# EAGLE design 18F Proto2 (EAGLE 6.6.0)
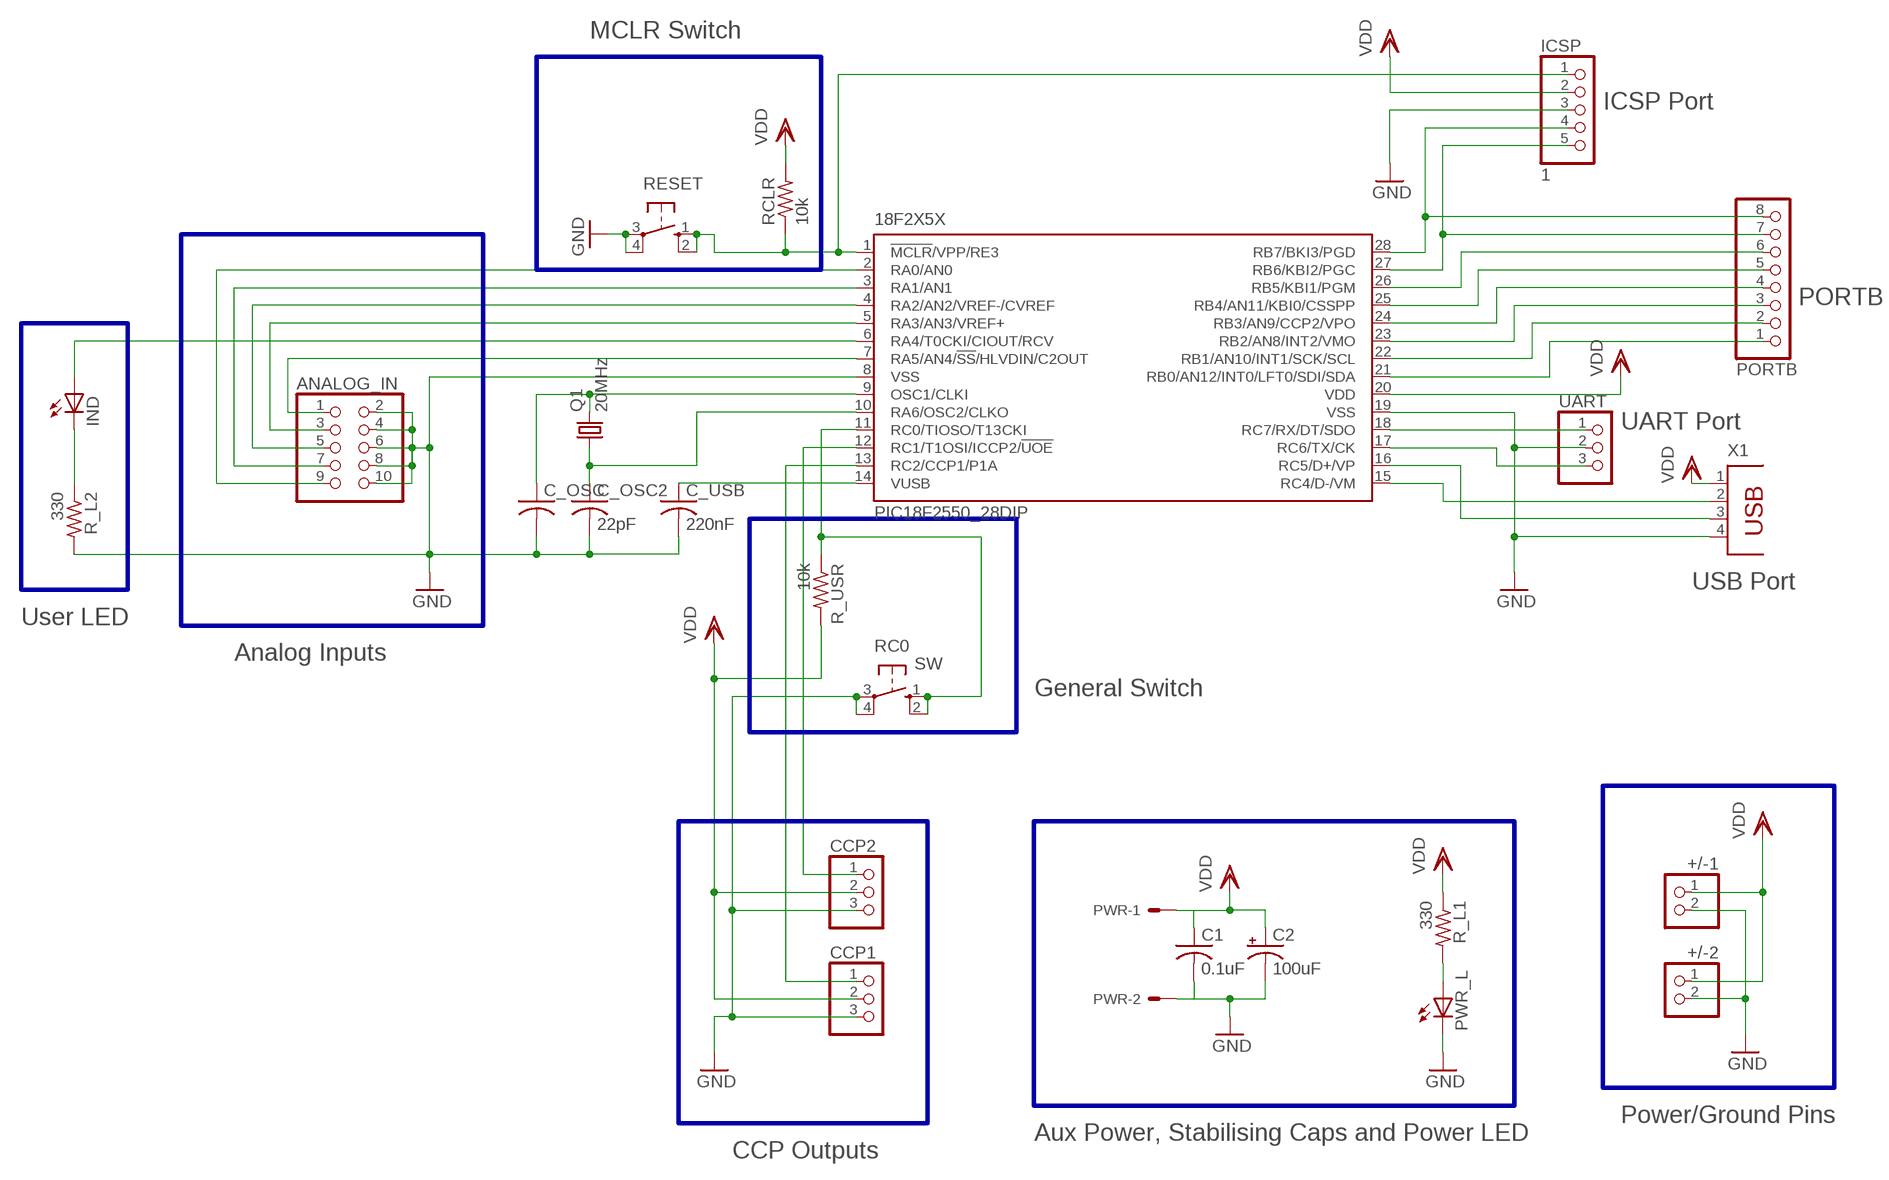
[diagram p0: schematic, sheet 1]

## Parts
18F2X5X  PIC18F2550_28DIP  [DIL28-3]
+/-1  PINHD-1X2  [1X02]
+/-2  PINHD-1X2  [1X02]
ANALOG_IN  PINHD-2X5  [2X05]
C1  0.1uF  C-US050-025X075  [C050-025X075]
C2  100uF  CPOL-USE2.5-6  [E2,5-6]
C_OSC  C-US025-025X050  [C025-025X050]
C_OSC2  22pF  C-US025-025X050  [C025-025X050]
C_USB  220nF  C-US050-025X075  [C050-025X075]
CCP1  PINHD-1X3  [1X03]
CCP2  PINHD-1X3  [1X03]
ICSP  1  PINHD-1X5  [1X05]
IND  LED3MM  [LED3MM]
PORTB  PINHD-1X8  [1X08]
PWR  22-23-2021  [22-23-2021]
PWR_L  LED3MM  [LED3MM]
Q1  20MHz  CRYSTALHC49S  [HC49/S]
R_L1  330  R-US_0204/7  [0204/7]
R_L2  330  R-US_0207/10  [0207/10]
R_USR  10k  R-US_0204/7  [0204/7]
RC0  SW  10-XX  [B3F-10XX]
RCLR  10k  R-US_0204/7  [0204/7]
RESET  10-XX  [B3F-10XX]
UART  PINHD-1X3  [1X03]
X1  PN61729  [PN61729]

## Nets
D+: 18F2X5X.16(RC5/D+/VP) X1.3
D-: 18F2X5X.15(RC4/D-/VM) X1.2
GND: 18F2X5X.8(VSS) 18F2X5X.19(VSS) +/-1.2 +/-2.2 ANALOG_IN.2 ANALOG_IN.4 ANALOG_IN.6 ANALOG_IN.8 ANALOG_IN.10 C1.2 C2.- C_OSC2.2 C_OSC.2 C_USB.2 CCP1.3 CCP2.3 ICSP.3 PWR.2 PWR_L.K(C) R_L2.2 RC0.3(P) RC0.4(P1) RESET.3(P) RESET.4(P1) UART.2 X1.4
MCLR: 18F2X5X.1(!MCLR!/VPP/RE3) ICSP.1 RCLR.1 RESET.1(S) RESET.2(S1)
N$4: 18F2X5X.10(RA6/OSC2/CLKO) C_OSC2.1 Q1.1
N$5: PWR_L.A R_L1.2
N$7: 18F2X5X.9(OSC1/CLKI) C_OSC.1 Q1.2
N$9: 18F2X5X.14(VUSB) C_USB.1
N$12: 18F2X5X.2(RA0/AN0) ANALOG_IN.9
N$13: 18F2X5X.3(RA1/AN1) ANALOG_IN.7
N$14: 18F2X5X.4(RA2/AN2/VREF-/CVREF) ANALOG_IN.5
N$15: 18F2X5X.5(RA3/AN3/VREF+) ANALOG_IN.3
N$16: 18F2X5X.6(RA4/T0CKI/CIOUT/RCV) IND.A
N$17: 18F2X5X.7(RA5/AN4/!SS!/HLVDIN/C2OUT) ANALOG_IN.1
N$18: IND.K(C) R_L2.1
N$19: 18F2X5X.11(RC0/TIOSO/T13CKI) R_USR.1 RC0.1(S) RC0.2(S1)
N$20: 18F2X5X.12(RC1/T1OSI/ICCP2/!UOE) CCP2.1
N$21: 18F2X5X.13(RC2/CCP1/P1A) CCP1.1
N$22: 18F2X5X.21(RB0/AN12/INT0/LFT0/SDI/SDA) PORTB.1
N$23: 18F2X5X.22(RB1/AN10/INT1/SCK/SCL) PORTB.2
N$24: 18F2X5X.23(RB2/AN8/INT2/VMO) PORTB.3
N$25: 18F2X5X.24(RB3/AN9/CCP2/VPO) PORTB.4
N$26: 18F2X5X.25(RB4/AN11/KBI0/CSSPP) PORTB.5
N$27: 18F2X5X.26(RB5/KBI1/PGM) PORTB.6
PGC: 18F2X5X.27(RB6/KBI2/PGC) ICSP.5 PORTB.7
PGD: 18F2X5X.28(RB7/BKI3/PGD) ICSP.4 PORTB.8
RX: 18F2X5X.18(RC7/RX/DT/SDO) UART.1
TX: 18F2X5X.17(RC6/TX/CK) UART.3
VDD: 18F2X5X.20(VDD) +/-1.1 +/-2.1 C1.1 C2.+ CCP1.2 CCP2.2 ICSP.2 PWR.1 R_L1.1 R_USR.2 RCLR.2 X1.1

## Buses
B$1
B$2
B$3
B$4
B$5
B$6
B$7

## Notes on the sheet
- MCLR Switch
- ICSP Port
- PORTB
- UART Port
- USB Port
- User LED
- Analog Inputs
- General Switch
- Power/Ground Pins
- Aux Power, Stabilising Caps and Power LED
- CCP Outputs

## Library data of the parts
18F2X5X = microchip:PIC18F2*_28: USB Microcontrollers with nanoWatt Technology High-Performance, Enhanced Flash, 28/40/44-Pin, Source: http://ww1.microchip.com/downloads/en/devicedoc/39632c.pdf; MF: MICROCHIP; MPN: PIC18F2550-I/SP; OC_FARNELL: 1523822; OC_NEWARK: 80K6054
+/-1 +/-2 = pinhead:PINHD-1X2: PIN HEADER
ANALOG_IN = pinhead:PINHD-2X5: PIN HEADER
C1 C_OSC C_OSC2 C_USB = rcl:C-US: CAPACITOR, American symbol
C2 = rcl:CPOL-US: POLARIZED CAPACITOR, American symbol
CCP1 CCP2 UART = pinhead:PINHD-1X3: PIN HEADER
ICSP = pinhead:PINHD-1X5: PIN HEADER
IND PWR_L = led:LED: LED OSRAM: - CHIPLED LG R971, LG N971, LY N971, LG Q971, LY Q971, LO R971, LY R971 LH N974, LH R974 LS Q976, LO Q976, LY Q976 LO Q996 - Hyper CHIPLED LW Q18S LB Q993, LB Q99A, LB R99A - SideLED LS A670, LO A670, LY A670, LG A670, LP A670 LB A673, LV A673, LT A673, LW A673 LH A674 LY A675 LS A676, LA A676, LO A676, LY A676, LW A676 LS A679, LY A679, LG A679 - Hyper Micro SIDELED® LS Y876, LA Y876, LO Y876, LY Y876 LT Y87S - SmartLED LW L88C, LW L88S LB L89C, LB L89S, LG L890 LS L89K, LO L89K, LY L89K LS L896, LA L896, LO L896, LY L896 - TOPLED LS T670, LO T670, LY T670, LG T670, LP T670 LSG T670, LSP T670, LSY T670, LOP T670, LYG T670 LG T671, LOG T671, LSG T671 LB T673, LV T673, LT T673, LW T673 LH T674 LS T676, LA T676, LO T676, LY T676, LB T676, LH T676, LSB T676, LW T676 LB T67C, LV T67C, LT T67C, LS T67K, LO T67K, LY T67K, LW E67C LS E67B, LA E67B, LO E67B, LY E67B, LB E67C, LV E67C, LT E67C LW T67C LS T679, LY T679, LG T679 LS T770, LO T770, LY T770, LG T770, LP T770 LB T773, LV T773, LT T773, LW T773 LH T774 LS E675, LA E675, LY E675, LS T675 LS T776, LA T776, LO T776, LY T776, LB T776 LHGB T686 LT T68C, LB T68C - Hyper Mini TOPLED® LB M676 - Mini TOPLED Santana® LG M470 LS M47K, LO M47K, LY M47K Source: http://www.osram.convergy.de LUXEON: - LUMILED® LXK2-PW12-R00, LXK2-PW12-S00, LXK2-PW14-U00, LXK2-PW14-V00 LXK2-PM12-R00, LXK2-PM12-S00, LXK2-PM14-U00 LXK2-PE12-Q00, LXK2-PE12-R00, LXK2-PE12-S00, LXK2-PE14-T00, LXK2-PE14-U00 LXK2-PB12-K00, LXK2-PB12-L00, LXK2-PB12-M00, LXK2-PB14-N00, LXK2-PB14-P00, LXK2-PB14-Q00 LXK2-PR12-L00, LXK2-PR12-M00, LXK2-PR14-Q00, LXK2-PR14-R00 LXK2-PD12-Q00, LXK2-PD12-R00, LXK2-PD12-S00 LXK2-PH12-R00, LXK2-PH12-S00 LXK2-PL12-P00, LXK2-PL12-Q00, LXK2-PL12-R00 Source: www.luxeon.com KINGBRIGHT: KA-3528ASYC Source: www.kingbright.com
PORTB = pinhead:PINHD-1X8: PIN HEADER
PWR = con-molex:22-23-2021: .100" (2.54mm) Center Header - 2 Pin; MF: MOLEX; MPN: 22-23-2021; OC_FARNELL: 1462926; OC_NEWARK: 25C3832
Q1 = crystal:CRYSTAL: CRYSTAL; OC_FARNELL: 1667008; OC_NEWARK: unknown
R_L1 R_L2 R_USR RCLR = rcl:R-US_: RESISTOR, American symbol
RC0 RESET = switch-omron:10-XX: OMRON SWITCH; MPN: B3F-1000; OC_FARNELL: 176432; OC_NEWARK: 36M3542
X1 = con-berg:PN61729: BERG USB connector; OC_FARNELL: unknown; OC_NEWARK: unknown

## Board
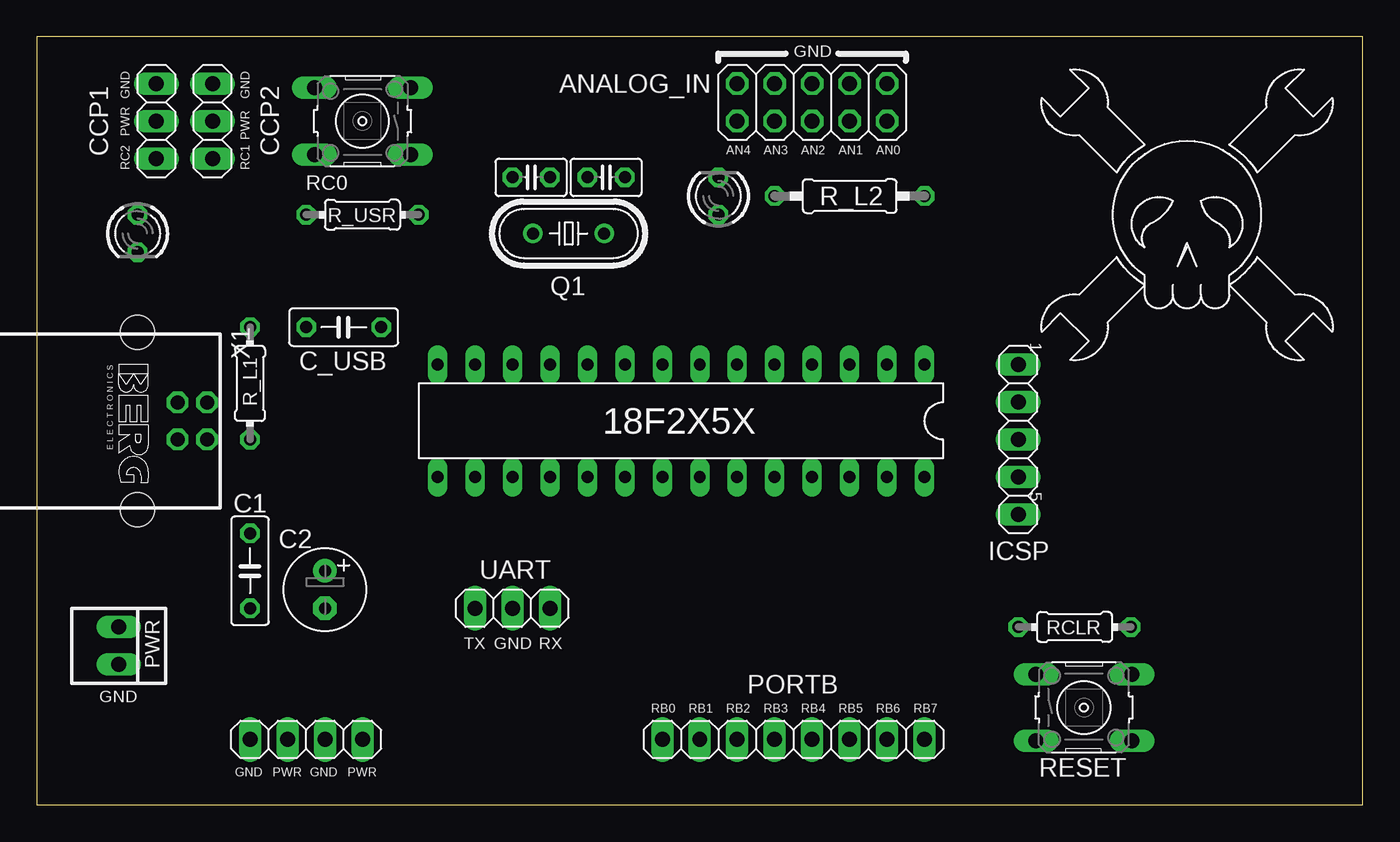
[diagram p1: board, top side]
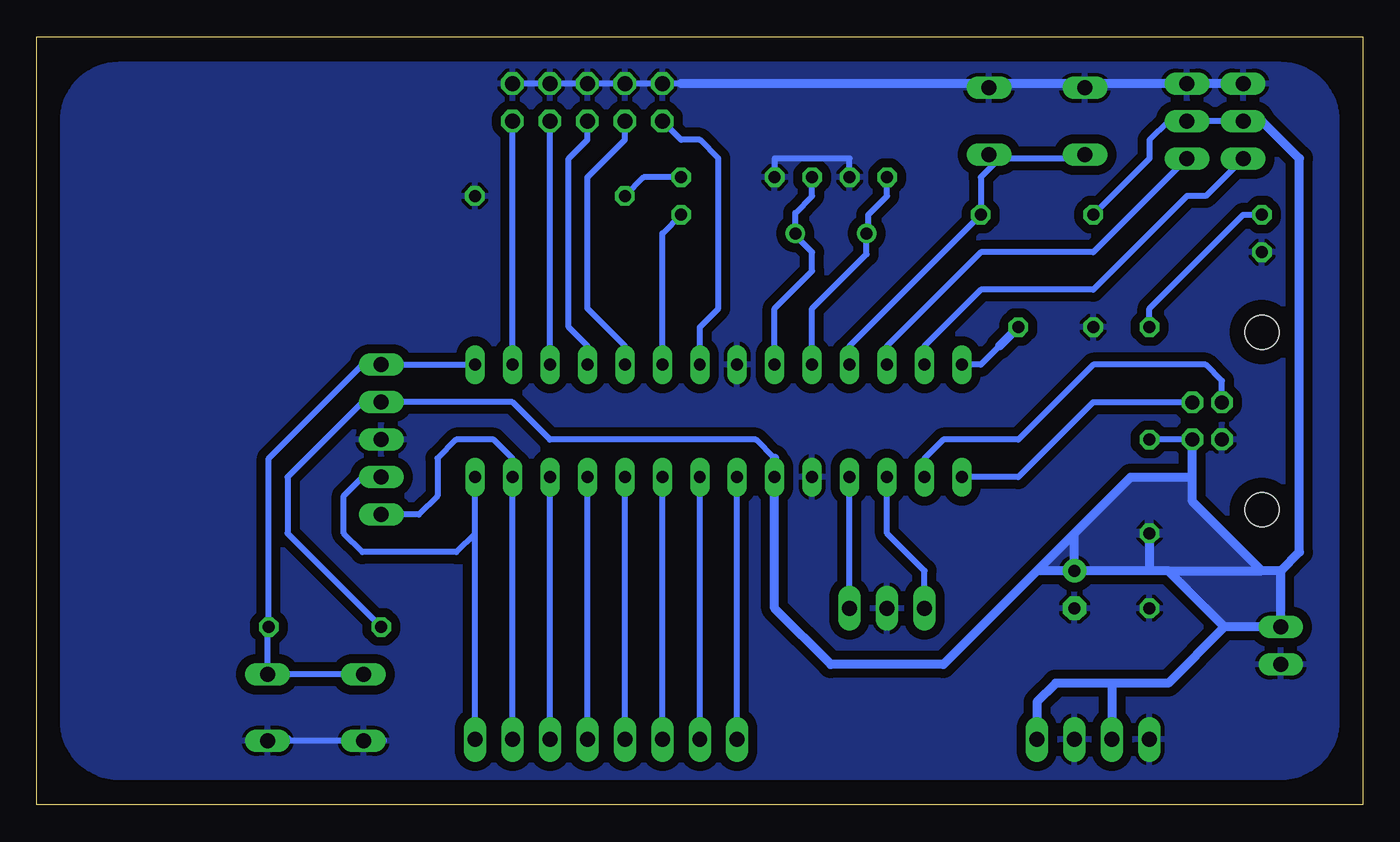
[diagram p2: board, bottom side, seen from below]

Size 89.84 x 52.06 mm. Coordinates in mm from the lower left corner, seen from the top.
Outline: 0,0 89.84,0 89.84,52.06 0,52.06 0,0
Copper layers (1*16): Top 0.035mm / dielectric 1.5mm / Bottom 0.035mm
Design rules "default *": minimum track width 10mil, minimum drill 24mil, track to track 8mil, track to pad 8mil, pad to pad 8mil, via to via 8mil, smd to smd 8mil, copper to edge 40mil, drill to drill 8mil, minimum pad ring 10mil, minimum via ring 8mil, stop-mask expansion 4mil, vias tented up to drill 0mil, thermal gap 10mil

### Footprints (pad centres in the part's own frame; a part is rotated, then mirrored left to right if it is on the bottom)
DIL28-3 = drill 0.813 long: 1 -16.51,-3.81; 2 -13.97,-3.81; 3 -11.43,-3.81; 4 -8.89,-3.81; 5 -6.35,-3.81; 6 -3.81,-3.81; 7 -1.27,-3.81; 8 1.27,-3.81; 9 3.81,-3.81; 10 6.35,-3.81; 11 8.89,-3.81; 12 11.43,-3.81; 13 13.97,-3.81; 14 16.51,-3.81; 15 16.51,3.81; 16 13.97,3.81; 17 11.43,3.81; 18 8.89,3.81; 19 6.35,3.81; 20 3.81,3.81; 21 1.27,3.81; 22 -1.27,3.81; 23 -3.81,3.81; 24 -6.35,3.81; 25 -8.89,3.81; 26 -11.43,3.81; 27 -13.97,3.81; 28 -16.51,3.81
1X02 = drill 1.016 long: 1 -1.27,0; 2 1.27,0
2X05 = drill 1.016 octagon: 1 -5.08,-1.27; 2 -5.08,1.27; 3 -2.54,-1.27; 4 -2.54,1.27; 5 0,-1.27; 6 0,1.27; 7 2.54,-1.27; 8 2.54,1.27; 9 5.08,-1.27; 10 5.08,1.27
C050-025X075 = drill 0.813 octagon: 1 -2.54,0; 2 2.54,0
E2,5-6 = drill 0.813 pad 1.6: + -1.27,0 | drill 0.813 pad 1.6 octagon: - 1.27,0
C025-025X050 = drill 0.813 octagon: 1 -1.27,0; 2 1.27,0
1X03 = drill 1.016 long: 1 -2.54,0; 2 0,0; 3 2.54,0
1X05 = drill 1.016 long: 1 -5.08,0; 2 -2.54,0; 3 0,0; 4 2.54,0; 5 5.08,0
LED3MM = drill 0.813 octagon: A -1.27,0; K 1.27,0
1X08 = drill 1.016 long: 1 -8.89,0; 2 -6.35,0; 3 -3.81,0; 4 -1.27,0; 5 1.27,0; 6 3.81,0; 7 6.35,0; 8 8.89,0
22-23-2021 = drill 1 long: 1 -1.27,0; 2 1.27,0
HC49/S = drill 0.813: 1 -2.413,0; 2 2.413,0
0204/7 = drill 0.813 octagon: 1 -3.81,0; 2 3.81,0
0207/10 = drill 0.813 octagon: 1 -5.08,0; 2 5.08,0
B3F-10XX = drill 1.016 long: 1 -3.251,2.261; 2 3.251,2.261; 3 -3.251,-2.261; 4 3.251,-2.261
PN61729 = drill 0.95 octagon: 1 1.25,4.71; 2 -1.25,4.71; 3 -1.25,2.71; 4 1.25,2.71 | hole 2.3: -6.02,0; 6.02,0

### Placement (x,y rotation side)
18F2X5X  43.65,26.03 180 top
+/-1  15.71,4.44 180 top
+/-2  20.79,4.44 180 top
ANALOG_IN  52.54,47.62 0 top
C1  14.44,15.87 270 top
C2  19.52,14.6 270 top
C_OSC  38.57,42.54 0 top
C_OSC2  33.49,42.54 0 top
C_USB  20.79,32.38 180 top
CCP1  8.09,46.35 90 top
CCP2  11.9,46.35 90 top
ICSP  66.51,24.76 270 top
IND  46.19,41.27 90 top
PORTB  51.27,4.44 0 top
PWR  5.55,10.79 270 top
PWR_L  6.82,38.73 270 top
Q1  36.03,38.73 0 top
R_L1  14.44,28.57 90 top
R_L2  55.08,41.27 0 top
R_USR  22.06,40 180 top
RC0  22.06,46.35 180 top
RCLR  70.32,12.06 180 top
RESET  70.95,6.6 0 top
U$1  [HACKADAY_S]  77.94,40 0 top
UART  32.22,13.33 180 top
X1  6.82,26.03 270 top

### Tracks (layer width: path | path; a pad name or v marks a point on that pad's centre or on a via)
D+
  Bottom 0.406: X1.3 9.53,28.74 10.63,29.84 18.25,29.84 23.33,24.76 28.41,24.76 29.68,23.49 18F2X5X.16
D-
  Bottom 0.406: 18F2X5X.15 23.33,22.22 18.25,27.3 18.23,27.28 X1.2
GND
  Bottom 0.406: C_OSC2.2 34.76,43.81 39.84,43.81 C_OSC.2 | 72.94,4.36 RESET.4 | RESET.3 72.76,4.34 72.86,4.44 | ANALOG_IN.10 ANALOG_IN.8 ANALOG_IN.6 ANALOG_IN.4 ANALOG_IN.2 46.19,48.89
  Bottom 0.61: RC0.4 19.24,48.61 19.52,48.89 | 19.52,48.89 24.6,48.89 | CCP1.3 CCP2.3 19.52,48.89 | RC0.3 24.88,48.61 24.6,48.89 | 24.6,48.89 46.19,48.89 | 72.86,4.44 72.94,4.36 | 66.51,4.44 66.43,4.36 RESET.3
  pour Bottom (isolate 0.61): 1.74,46.35 arc-90 5.55,50.16 84.29,50.16 arc-90 88.1,46.35 88.1,5.71 arc-90 84.29,1.9 5.55,1.9 arc-90 1.74,5.71
MCLR
  Bottom 0.406: RESET.1 RESET.2 74.21,11.98 RCLR.1 74.13,23.49 67.78,29.84 ICSP.1 18F2X5X.1
N$4
  Bottom 0.406: C_OSC2.1 32.22,41.27 33.49,40 33.49,38.73 Q1.1 33.62,37.33 37.3,33.65 18F2X5X.10
N$5
  Bottom 0.406: R_L1.2 14.44,33.65 8.09,40 PWR_L.A
N$7
  Bottom 0.406: C_OSC.1 37.3,41.27 38.44,40.13 Q1.2 38.57,38.73 37.3,37.46 37.3,36.19 39.84,33.65 18F2X5X.9
N$9
  Bottom 0.406: 24.6,31.11 25.87,29.84 18F2X5X.14
  Bottom 0.61: C_USB.1 24.6,31.11
N$12
  Bottom 0.406: 18F2X5X.2 ANALOG_IN.9
N$13
  Bottom 0.406: 18F2X5X.3 ANALOG_IN.7
N$14
  Bottom 0.406: ANALOG_IN.5 52.54,45.08 53.81,43.81 53.81,32.38 52.54,31.11 18F2X5X.4
N$15
  Bottom 0.406: ANALOG_IN.3 50,45.08 52.54,42.54 52.54,33.65 50,31.11 18F2X5X.5
N$16
  Bottom 0.406: IND.A 47.46,38.73 18F2X5X.6
N$17
  Bottom 0.406: ANALOG_IN.1 46.19,45.08 44.92,45.08 43.65,43.81 43.65,33.65 44.92,32.38 18F2X5X.7
N$18
  Bottom 0.406: IND.K 48.73,42.54 R_L2.1
N$19
  Bottom 0.406: RC0.2 19.24,44.09 19.52,43.81 24.6,43.81 | RC0.1 24.88,44.09 24.6,43.81 | 24.6,43.81 25.87,42.54 R_USR.1 34.76,31.11 18F2X5X.11
N$20
  Bottom 0.406: CCP2.1 18.25,37.46 25.87,37.46 32.22,31.11 18F2X5X.12
N$21
  Bottom 0.406: CCP1.1 10.63,41.27 11.9,41.27 18.25,34.92 25.87,34.92 29.68,31.11 18F2X5X.13
N$22
  Bottom 0.406: PORTB.1 18F2X5X.21
N$23
  Bottom 0.406: PORTB.2 18F2X5X.22
N$24
  Bottom 0.406: PORTB.3 18F2X5X.23
N$25
  Bottom 0.406: PORTB.4 18F2X5X.24
N$26
  Bottom 0.406: PORTB.5 18F2X5X.25
N$27
  Bottom 0.406: PORTB.6 18F2X5X.26
PGC
  Bottom 0.406: PORTB.7 18F2X5X.27 57.62,23.49 58.89,24.76 61.43,24.76 62.7,23.49 62.7,20.95 63.97,19.68 ICSP.5
PGD
  Bottom 0.406: PORTB.8 60.16,18.41 | 60.16,18.41 18F2X5X.28 | 60.16,18.41 61.43,17.14 67.78,17.14 69.05,18.41 69.05,20.95 67.78,22.22 ICSP.4
RX
  Bottom 0.406: UART.1 18F2X5X.18
TX
  Bottom 0.406: UART.3 29.68,15.87 32.22,18.41 18F2X5X.17
VDD
  Bottom 0.406: R_USR.2 14.44,43.81 14.44,45.08 13.17,46.35 CCP2.2 CCP1.2 | 39.84,23.49 41.11,24.76 55.08,24.76 57.62,27.3 ICSP.2 67.78,27.3 72.86,22.22 72.86,18.41 RCLR.2 | X1.1 14.42,24.78 R_L1.1
  Bottom 0.61: 5.55,15.87 4.28,17.14 4.28,43.81 6.82,46.35 CCP1.2 | 16.98,8.25 20.79,8.25 22.06,6.98 +/-2.1 | 16.98,8.25 +/-1.1 | 5.55,15.87 PWR.1 9.36,12.06 | 39.84,23.49 18F2X5X.20 39.84,13.33 36.03,9.52 28.41,9.52 22.06,15.87 | 16.98,8.25 13.17,8.25 9.36,12.06 | C2.+ 19.52,18.41 | C2.+ 22.06,15.87 | 5.55,15.87 6.82,15.87 | 19.52,18.41 22.06,15.87 | 19.52,18.41 15.71,22.22 11.9,22.22 | 13.17,15.87 6.82,15.87 | 13.17,15.87 14.44,15.87 | 14.44,15.87 C2.+ | X1.1 11.53,20.58 6.82,15.87 | 9.36,12.06 13.17,15.87 | C1.1 14.44,15.87
  pour Bottom: 5.55,12.06 9.36,12.06 13.17,15.87 22.06,15.87 15.71,22.22 11.9,22.22 11.9,20.95 6.82,15.87 5.55,15.87

### Text on the board
tNames: GND | GND | GND | PWR | PWR | AN4 | AN3 | AN2 | AN1 | AN0 | RC2 | RC1 | 1 | 5 | TX | GND | RX | GND | RB0 | RB1 | RB2 | RB3 | RB4 | RB5 | RB6 | RB7 | GND | PWR | GND | PWR